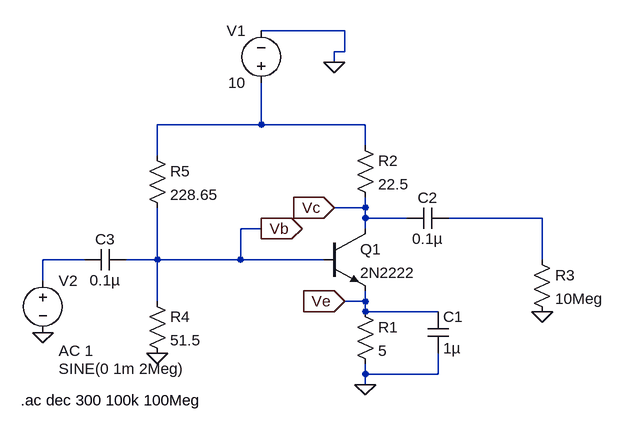
[diagram p0: schematic Draft12.asc]
Draft12.asc, the LTspice schematic file:
Version 4
SHEET 1 880 680
WIRE 224 -160 96 -160
WIRE 224 -128 224 -160
WIRE 224 -128 208 -128
WIRE 208 -112 208 -128
WIRE 96 -16 96 -80
WIRE 96 -16 -64 -16
WIRE 256 -16 96 -16
WIRE 256 16 256 -16
WIRE -64 32 -64 -16
WIRE 256 112 256 96
WIRE 256 112 208 112
WIRE 256 128 256 112
WIRE 320 128 256 128
WIRE 528 128 384 128
WIRE 96 144 64 144
WIRE 256 144 256 128
WIRE -176 192 -240 192
WIRE -64 192 -64 112
WIRE -64 192 -112 192
WIRE 64 192 64 144
WIRE 64 192 -64 192
WIRE 192 192 64 192
WIRE 528 192 528 128
WIRE -240 224 -240 192
WIRE -64 256 -64 192
WIRE 256 256 256 240
WIRE 256 256 224 256
WIRE 256 272 256 256
WIRE 368 272 256 272
WIRE 256 368 256 352
WIRE 368 368 368 336
WIRE 368 368 256 368
WIRE 256 384 256 368
FLAG 256 384 0
FLAG 528 272 0
FLAG -64 336 0
FLAG 208 -112 0
FLAG -240 304 0
FLAG 208 112 Vc
IOPIN 208 112 In
FLAG 224 256 Ve
IOPIN 224 256 In
FLAG 96 144 Vb
IOPIN 96 144 Out
SYMBOL npn 192 144 R0
SYMATTR InstName Q1
SYMATTR Value 2N2222
SYMBOL res 240 256 R0
SYMATTR InstName R1
SYMATTR Value 5
SYMBOL cap 352 272 R0
SYMATTR InstName C1
SYMATTR Value 1µ
SYMBOL res 240 0 R0
SYMATTR InstName R2
SYMATTR Value 22.5
SYMBOL cap 384 112 R90
WINDOW 0 0 32 VBottom 2
WINDOW 3 32 32 VTop 2
SYMATTR InstName C2
SYMATTR Value 0.1µ
SYMBOL res 512 176 R0
SYMATTR InstName R3
SYMATTR Value 10Meg
SYMBOL res -80 240 R0
SYMATTR InstName R4
SYMATTR Value 51.5
SYMBOL res -80 16 R0
SYMATTR InstName R5
SYMATTR Value 228.65
SYMBOL voltage 96 -64 R180
WINDOW 0 24 96 Left 2
WINDOW 3 24 16 Left 2
WINDOW 123 0 0 Left 0
WINDOW 39 0 0 Left 0
SYMATTR InstName V1
SYMATTR Value 10
SYMBOL voltage -240 208 R0
WINDOW 3 24 152 Left 2
WINDOW 123 24 124 Left 2
WINDOW 39 0 0 Left 0
SYMATTR InstName V2
SYMATTR Value SINE(0 1m 2Meg)
SYMATTR Value2 AC 1
SYMBOL cap -112 176 R90
WINDOW 0 0 32 VBottom 2
WINDOW 3 32 32 VTop 2
SYMATTR InstName C3
SYMATTR Value 0.1µ
TEXT -274 408 Left 2 !.ac dec 300 100k 100Meg

The netlist it stands for:
* Draft12.asc
Q1 Vc Vb Ve 0 2N2222
R1 Ve 0 5
C1 Ve 0 1µ
R2 N001 Vc 22.5
C2 N002 Vc 0.1µ
R3 N002 0 10Meg
R4 Vb 0 51.5
R5 N001 Vb 228.65
V1 N001 0 10
V2 N003 0 SINE(0 1m 2Meg) AC 1
C3 Vb N003 0.1µ
.model NPN NPN
.model PNP PNP
.lib standard.bjt
.ac dec 300 100k 100Meg
.backanno
.end